# Altium schematic sheet 3-PWR_MANAGE_2.SCHDOC: 控制板
size A4; CompanyName: 然源电子; DrawnBy: lzl; Revision: Rev 01
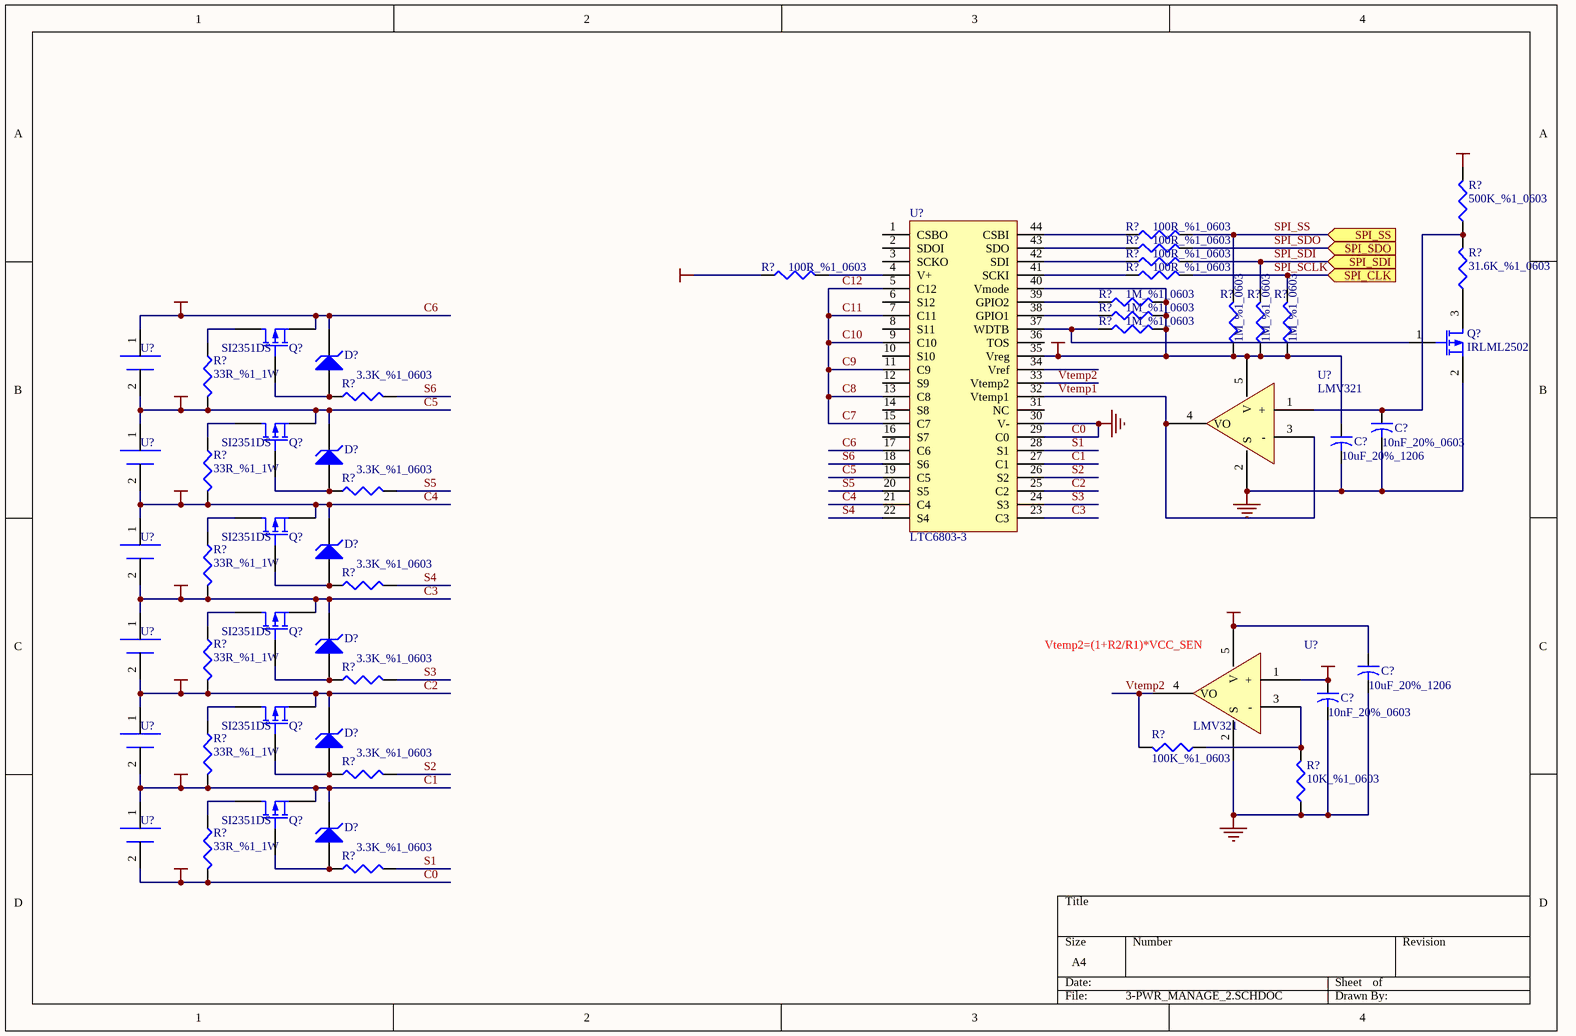
[diagram p0: 3-PWR_MANAGE_2.SCHDOC]

## Parts
(Parts that share a designator on the sheet are numbered #1, #2 ... from top to bottom, then left to right.)
C?#1  value 10nF_20%_0603  [C1608-0603]  (hidden comment: Cap2)
C?#2  value 10uF_20%_1206  [C1608-0603]  (hidden comment: Cap2)
C?#3  value 10uF_20%_1206  [C1608-0603]  (hidden comment: Cap2)
C?#4  value 10nF_20%_0603  [C1608-0603]  (hidden comment: Cap2)
D?#1  D Zener  [DIODE-0.7]  (value not drawn)
D?#2  D Zener  [DIODE-0.7]  (value not drawn)
D?#3  D Zener  [DIODE-0.7]  (value not drawn)
D?#4  D Zener  [DIODE-0.7]  (value not drawn)
D?#5  D Zener  [DIODE-0.7]  (value not drawn)
D?#6  D Zener  [DIODE-0.7]  (value not drawn)
Q?#1  IRLML2502  [BCY-W3/B.8]
Q?#2  SI2351DS  [BCY-W3/B.8]
Q?#3  SI2351DS  [BCY-W3/B.8]
Q?#4  SI2351DS  [BCY-W3/B.8]
Q?#5  SI2351DS  [BCY-W3/B.8]
Q?#6  SI2351DS  [BCY-W3/B.8]
Q?#7  SI2351DS  [BCY-W3/B.8]
R?#1  value 100R_%1_0603  [C1608-0603]  (hidden comment: Res3)
R?#2  value 500K_%1_0603  [C1608-0603]  (hidden comment: Res3)
R?#3  value 100R_%1_0603  [C1608-0603]  (hidden comment: Res3)
R?#4  value 100R_%1_0603  [C1608-0603]  (hidden comment: Res3)
R?#5  value 100R_%1_0603  [C1608-0603]  (hidden comment: Res3)
R?#6  value 100R_%1_0603  [C1608-0603]  (hidden comment: Res3)
R?#7  value 1M_%1_0603  [C1608-0603]  (hidden comment: Res3)
R?#8  value 31.6K_%1_0603  [C1608-0603]  (hidden comment: Res3)
R?#9  value 1M_%1_0603  [C1608-0603]  (hidden comment: Res3)
R?#10  value 1M_%1_0603  [C1608-0603]  (hidden comment: Res3)
R?#11  value 1M_%1_0603  [C1608-0603]  (hidden comment: Res3)
R?#12  value 1M_%1_0603  [C1608-0603]  (hidden comment: Res3)
R?#13  value 1M_%1_0603  [C1608-0603]  (hidden comment: Res3)
R?#14  value 33R_%1_1W  [C1608-0603]  (hidden comment: Res3)
R?#15  value 3.3K_%1_0603  [C1608-0603]  (hidden comment: Res3)
R?#16  value 33R_%1_1W  [C1608-0603]  (hidden comment: Res3)
R?#17  value 3.3K_%1_0603  [C1608-0603]  (hidden comment: Res3)
R?#18  value 33R_%1_1W  [C1608-0603]  (hidden comment: Res3)
R?#19  value 3.3K_%1_0603  [C1608-0603]  (hidden comment: Res3)
R?#20  value 33R_%1_1W  [C1608-0603]  (hidden comment: Res3)
R?#21  value 3.3K_%1_0603  [C1608-0603]  (hidden comment: Res3)
R?#22  value 33R_%1_1W  [C1608-0603]  (hidden comment: Res3)
R?#23  value 3.3K_%1_0603  [C1608-0603]  (hidden comment: Res3)
R?#24  value 100K_%1_0603  [C1608-0603]  (hidden comment: Res3)
R?#25  value 10K_%1_0603  [C1608-0603]  (hidden comment: Res3)
R?#26  value 33R_%1_1W  [C1608-0603]  (hidden comment: Res3)
R?#27  value 3.3K_%1_0603  [C1608-0603]  (hidden comment: Res3)
U?#1  LTC6803-3
U?#2  BATTERY  (value not drawn)
U?#3  LMV321
U?#4  BATTERY  (value not drawn)
U?#5  BATTERY  (value not drawn)
U?#6  BATTERY  (value not drawn)
U?#7  LMV321
U?#8  BATTERY  (value not drawn)
U?#9  BATTERY  (value not drawn)

## Ports
SPI_CLK (in), SPI_SDI (in), SPI_SDO (in), SPI_SS (in)

## Nets
C0: C?#1.2 C?#2.2 C?#3.2 C?#4.2 Q?#1.2(S) R?#25.1 R?#26.2 U?#1.29(C0) U?#1.30(V-) U?#3.2(S) U?#7.2(S) U?#9.2(+)  [also labelled CELL0, GND]
C1: D?#6.2(K) Q?#7.3(S) R?#22.2 U?#1.27(C1) U?#8.2(+) U?#9.1(+)  [also labelled CELL1]
C2: D?#5.2(K) Q?#6.3(S) R?#20.2 U?#1.25(C2) U?#6.2(+) U?#8.1(+)  [also labelled CELL2]
C3: D?#4.2(K) Q?#5.3(S) R?#18.2 U?#1.23(C3) U?#5.2(+) U?#6.1(+)  [also labelled CELL3]
C4: D?#3.2(K) Q?#4.3(S) R?#16.2 U?#1.21(C4) U?#4.2(+) U?#5.1(+)  [also labelled CELL4]
C5: D?#2.2(K) Q?#3.3(S) R?#14.2 U?#1.19(C5) U?#2.2(+) U?#4.1(+)  [also labelled CELL5]
C6: D?#1.2(K) Q?#2.3(S) R?#2.2 R?#5.1 U?#1.17(C6) U?#2.1(+)  [also labelled CELL6]
VCC_REG_5V: C?#2.1 C?#3.1 R?#7.2 R?#9.2 R?#10.2 R?#11.1 R?#12.1 R?#13.1 U?#1.35(Vreg) U?#1.40(Vmode) U?#3.5(V) U?#7.5(V)
VCC_SEN: C?#4.1 U?#7.1(+)
C10: U?#1.5(C12) U?#1.7(C11) U?#1.9(C10) U?#1.11(C9) U?#1.13(C8) U?#1.15(C7)  [also labelled C11, C12, C7, C8, C9]
S1: R?#27.2 U?#1.28(S1)
S2: R?#23.2 U?#1.26(S2)
S3: R?#21.2 U?#1.24(S3)
S4: R?#19.2 U?#1.22(S4)
S5: R?#17.2 U?#1.20(S5)
S6: R?#15.2 U?#1.18(S6)
SPI_SCLK: R?#6.2 R?#13.2 ; port SPI_CLK
SPI_SDI: R?#4.2 R?#12.2 ; port SPI_SDI
SPI_SDO: R?#3.2 ; port SPI_SDO
SPI_SS: R?#1.2 R?#11.2 ; port SPI_SS
Vtemp1: U?#1.32(Vtemp1) U?#3.3(-) U?#3.4(VO)
Vtemp2: R?#24.2 U?#1.33(Vtemp2) U?#7.4(VO)
NetC?#1_1: C?#1.1 R?#2.1 R?#8.2 U?#3.1(+)
NetD?#1_1: D?#1.1(A) Q?#2.2(G) R?#15.1
NetD?#2_1: D?#2.1(A) Q?#3.2(G) R?#17.1
NetD?#3_1: D?#3.1(A) Q?#4.2(G) R?#19.1
NetD?#4_1: D?#4.1(A) Q?#5.2(G) R?#21.1
NetD?#5_1: D?#5.1(A) Q?#6.2(G) R?#23.1
NetD?#6_1: D?#6.1(A) Q?#7.2(G) R?#27.1
NetQ?#1_1: Q?#1.1(G) R?#10.1 U?#1.37(WDTB)
NetQ?#1_3: Q?#1.3(D) R?#8.1
NetQ?#2_1: Q?#2.1(D) R?#14.1
NetQ?#3_1: Q?#3.1(D) R?#16.1
NetQ?#4_1: Q?#4.1(D) R?#18.1
NetQ?#5_1: Q?#5.1(D) R?#20.1
NetQ?#6_1: Q?#6.1(D) R?#22.1
NetQ?#7_1: Q?#7.1(D) R?#26.1
NetR?#1_1: R?#1.1 U?#1.44(CSBI)
NetR?#3_1: R?#3.1 U?#1.43(SDO)
NetR?#4_1: R?#4.1 U?#1.42(SDI)
NetR?#5_2: R?#5.2 U?#1.4(V+)
NetR?#6_1: R?#6.1 U?#1.41(SCKI)
NetR?#7_1: R?#7.1 U?#1.39(GPIO2)
NetR?#9_1: R?#9.1 U?#1.38(GPIO1)
NetR?#24_1: R?#24.1 R?#25.2 U?#7.3(-)

Not connected (* = marked no-connect by the designer): U?#1 1(CSBO) 2(SDOI) 3(SCKO) 6(S12) 8(S11) 10(S10) 12(S9) 14(S8) 16(S7) 31(NC) 34(Vref) 36(TOS)

## Notes on the sheet
- (near U?#7) Vtemp2=(1+R2/R1)*VCC_SEN

## Library data of the parts
C?#1-C?#4 = Cap2: Capacitor; Published: 23-Sep-2002; Publisher: Altium Limited
D?#1-D?#6 = D Zener: Zener Diode; Published: 8-Jun-2000; LatestRevisionDate: 17-Jul-2002; LatestRevisionNote: Re-released for DXP Platform.; Publisher: Altium Limited
Q?#1-Q?#7 = MOSFET-P: P-Channel MOSFET; Published: 8-Jun-2000; LatestRevisionDate: 17-Jul-2002; LatestRevisionNote: Re-released for DXP Platform.; Publisher: Altium Limited
R?#1-R?#27 = Res3: Resistor; Published: 8-Jun-2000; Revision: July-2002: Re-released for DXP Platform.; Publisher: Altium Limited